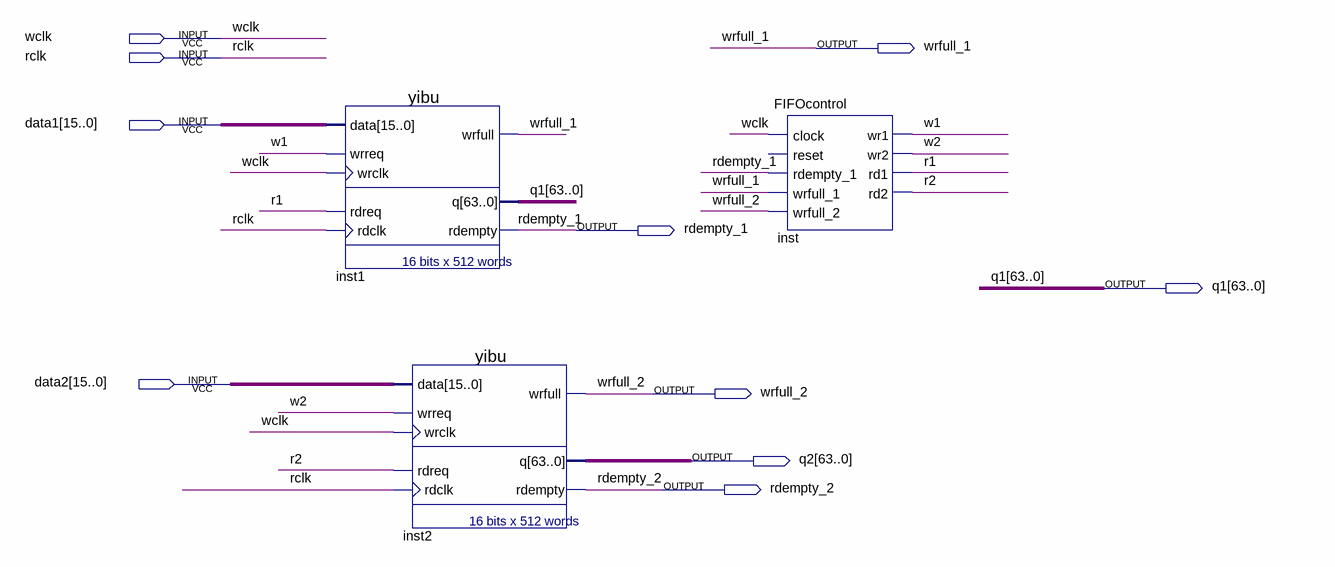
[diagram p0: schematic sheet]
// Quartus schematic pingpang.bdf as structural Verilog: 3 symbols, 10 pins
module pingpang (
  input  wclk,
  input  rclk,
  input  [15:0] data1,
  input  [15:0] data2,
  output wrfull_1,
  output rdempty_1,
  output [63:0] q1,
  output wrfull_2,
  output [63:0] q2,
  output rdempty_2
);

  wire r1, r2, w1, w2;

  yibu inst1 (
    .data(data1), .wrreq(w1), .wrclk(wclk), .rdreq(r1), .rdclk(rclk), .wrfull(wrfull_1), .q(q1),
    .rdempty(rdempty_1));
  yibu inst2 (
    .data(data2), .wrreq(w2), .wrclk(wclk), .rdreq(r2), .rdclk(rclk), .wrfull(wrfull_2), .q(q2),
    .rdempty(rdempty_2));
  FIFOcontrol inst (
    .clock(wclk), .rdempty_1(rdempty_1), .wrfull_1(wrfull_1), .wrfull_2(wrfull_2), .wr1(w1), .wr2(w2),
    .rd1(r1), .rd2(r2));  // open: reset
endmodule
